# EAGLE design internal_env_board (EAGLE 8.4.3)
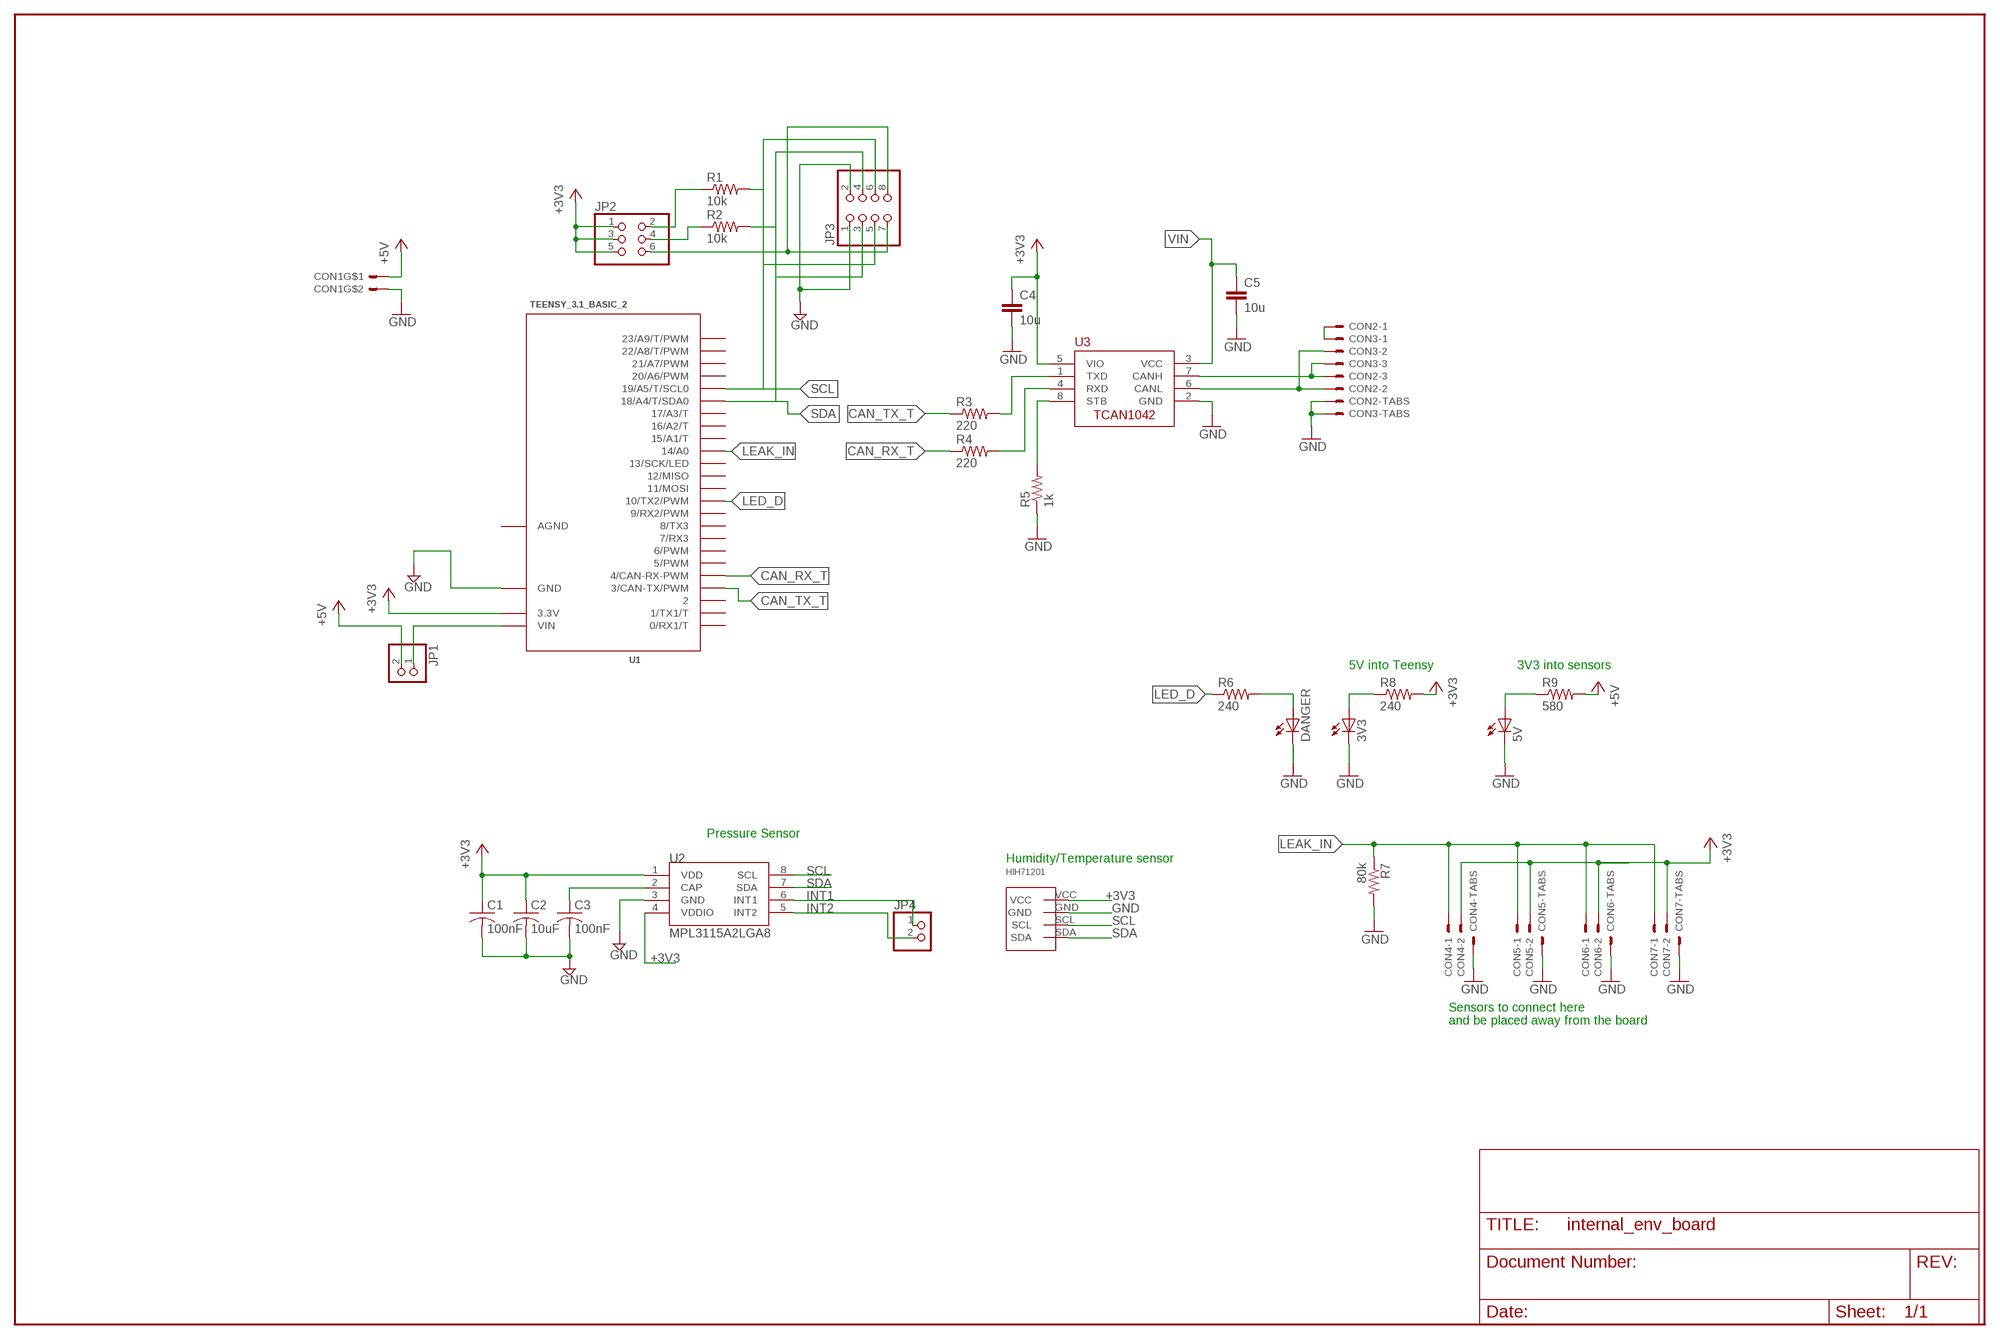
[diagram p0: schematic, sheet 1]

## Parts
3V3  LEDSMT1206  [1206]
5V  LEDSMT1206  [1206]
C1  100nF  C-USC1206  [C1206]
C2  10uF  C-USC1206  [C1206]
C3  100nF  C-USC1206  [C1206]
C4  10u  C-EUC0805  [C0805]
C5  10u  C-EUC0805  [C0805]
CON1  MOLEX_5566-2  [5566-2]
CON2  SM03B-GHS-TB  [SM03B-GHS-TB]
CON3  SM03B-GHS-TB  [SM03B-GHS-TB]
CON4  SM02B-GHS-TB  [SM02B-GHS-TB]
CON5  SM02B-GHS-TB  [SM02B-GHS-TB]
CON6  SM02B-GHS-TB  [SM02B-GHS-TB]
CON7  SM02B-GHS-TB  [SM02B-GHS-TB]
DANGER  LEDSMT1206  [1206]
HIH71201  HIH7120  [SIP4]
JP1  PINHD-1X2  [1X02]
JP2  PINHD-2X3  [2X03]
JP3  PINHD-2X4  [2X04]
JP4  PINHD-1X2  [1X02]
R1  10k  R-US_R1206  [R1206]
R2  10k  R-US_R1206  [R1206]
R3  220  R-US_R0805  [R0805]
R4  220  R-US_R0805  [R0805]
R5  1k  R-US_R0805  [R0805]
R6  240  R-US_R1206  [R1206]
R7  80k  R-US_R1206  [R1206]
R8  240  R-US_R1206  [R1206]
R9  580  R-US_R1206  [R1206]
U1  TEENSY_3.1_BASIC_2  [TEENSY_3.1_BASIC_2]
U2  MPL3115A2LGA8  [LGA8]
U3  TCAN1042HVDR  [SO-8]

## Nets
+3V3: C1.1 C2.1 C4.1 CON4.P$2 CON5.P$2 CON6.P$2 CON7.P$2 HIH71201.VCC JP2.1 JP2.3 JP2.5 R8.2 U1.3.3V U2.1(VDD) U2.4(VDDIO) U3.5(VIO)
+5V: CON1.1 JP1.2 R9.2
CAN_RX1: R4.2 U3.4(RXD)
CAN_RX_T: R4.1 U1.4(4/CAN-RX-PWM)
CAN_TX2: R3.2 U3.1(TXD)
CAN_TX_T: R3.1 U1.3(3/CAN-TX/PWM)
CANH1: CON2.P$3 CON3.P$3 U3.7(CANH)
CANL1: CON2.P$2 CON3.P$2 U3.6(CANL)
CANSH1: CON2.P$1 CON3.P$1
CAP: C3.1 U2.2(CAP)
GND: 3V3.C 5V.C C1.2 C2.2 C3.2 C4.2 C5.2 CON1.2 CON2.P$4 CON2.P$5 CON3.P$4 CON3.P$5 CON4.P$3 CON4.P$4 CON5.P$3 CON5.P$4 CON6.P$3 CON6.P$4 CON7.P$3 CON7.P$4 DANGER.C HIH71201.GND JP3.1 JP3.2 R5.1 R7.2 U1.GND U2.3(GND) U3.2(GND)
I2C_3V1: JP2.6 JP3.7 JP3.8
INT1: JP4.1 U2.6(INT1)
INT2: JP4.2 U2.5(INT2)
LEAK_IN: CON4.P$1 CON5.P$1 CON6.P$1 CON7.P$1 R7.1 U1.14/A0
LED_D: R6.1 U1.10(10/TX2/PWM)
N$2: DANGER.A R6.2
N$4: 5V.A R9.1
N$17: 3V3.A R8.1
SCL: HIH71201.SCL JP3.5 JP3.6 R1.2 U1.19/A5(19/A5/T/SCL0) U2.8(SCL)
SCL_3V1: JP2.2 R1.1
SDA: HIH71201.SDA JP3.3 JP3.4 R2.2 U1.18/A4(18/A4/T/SDA0) U2.7(SDA)
SDA_3V1: JP2.4 R2.1
STB1: R5.2 U3.8(STB)
VIN: C5.1 JP1.1 U1.VIN U3.3(VCC)
Unconnected: U1.0(0/RX1/T) U1.1(1/TX1/T) U1.2 U1.5(5/PWM) U1.6(6/PWM) U1.7(7/RX3) U1.8(8/TX3) U1.9(9/RX2/PWM) U1.11(11/MOSI) U1.12(12/MISO) U1.13(13/SCK/LED) U1.15/A1(15/A1/T) U1.16/A2(16/A2/T) U1.17/A3(17/A3/T) U1.20/A6(20/A6/PWM) U1.21/A7(21/A7/PWM) U1.22/A8(22/A8/T/PWM) U1.23/A9(23/A9/T/PWM)

## Notes on the sheet
- 5V into Teensy | 3V3 into sensors
- Pressure Sensor
- Humidity/Temperature sensor
- Sensors to connect here
  and be placed away from the board

## Power pins joined to a net without a drawn wire
AGND: U1.AGND

## Library data of the parts
3V3 5V DANGER = adafruit:LED: LED OSRAM: - CHIPLED LG R971, LG N971, LY N971, LG Q971, LY Q971, LO R971, LY R971 LH N974, LH R974 LS Q976, LO Q976, LY Q976 LO Q996 - Hyper CHIPLED LW Q18S LB Q993, LB Q99A, LB R99A - SideLED LS A670, LO A670, LY A670, LG A670, LP A670 LB A673, LV A673, LT A673, LW A673 LH A674 LY A675 LS A676, LA A676, LO A676, LY A676, LW A676 LS A679, LY A679, LG A679 - Hyper Micro SIDELED® LS Y876, LA Y876, LO Y876, LY Y876 LT Y87S - SmartLED LW L88C, LW L88S LB L89C, LB L89S, LG L890 LS L89K, LO L89K, LY L89K LS L896, LA L896, LO L896, LY L896 - TOPLED LS T670, LO T670, LY T670, LG T670, LP T670 LSG T670, LSP T670, LSY T670, LOP T670, LYG T670 LG T671, LOG T671, LSG T671 LB T673, LV T673, LT T673, LW T673 LH T674 LS T676, LA T676, LO T676, LY T676, LB T676, LH T676, LSB T676, LW T676 LB T67C, LV T67C, LT T67C, LS T67K, LO T67K, LY T67K, LW E67C LS E67B, LA E67B, LO E67B, LY E67B, LB E67C, LV E67C, LT E67C LW T67C LS T679, LY T679, LG T679 LS T770, LO T770, LY T770, LG T770, LP T770 LB T773, LV T773, LT T773, LW T773 LH T774 LS E675, LA E675, LY E675, LS T675 LS T776, LA T776, LO T776, LY T776, LB T776 LHGB T686 LT T68C, LB T68C - Hyper Mini TOPLED® LB M676 - Mini TOPLED Santana® LG M470 LS M47K, LO M47K, LY M47K Source: http://www.osram.convergy.de/
C1-C3 = rcl:C-US: CAPACITOR, American symbol
C4 C5 = rcl:C-EU: CAPACITOR, European symbol
CON1 = ARVP:MOLEX_5566-2
CON2 CON3 = ARVP:SM03B-GHS-TB
CON4-CON7 = ARVP:SM02B-GHS-TB
HIH71201 = HIH7120:HIH7120: A humidity and temperature sensor from honeywell. 2.3-5V operating voltage -40 to 85 temperature range Digikey Part #: HIH7120-021-001CT-ND
JP1 JP4 = pinhead:PINHD-1X2: PIN HEADER
JP2 = pinhead:PINHD-2X3: PIN HEADER
JP3 = pinhead:PINHD-2X4: PIN HEADER
R1-R5 = rcl:R-US_: RESISTOR, American symbol
R6-R9 = resistor:R-US_: RESISTOR, American symbol
U1 = Teensy_3_Series_Board_v1.0:TEENSY_3.1_BASIC_2: Footprint for Teensy 3.1 board using all pin connections on the outer perimeter
U2 = SparkFun-Sensors:MPL3115A2: Altimeter/Pressure Sensor, I2C, 1.95V-3.6V supply, 50 to 110kPa
U3 = ARVP:TCAN1042HVDR

## Net classes
1 net1: clearance 0.203 mm to class 0

## Board
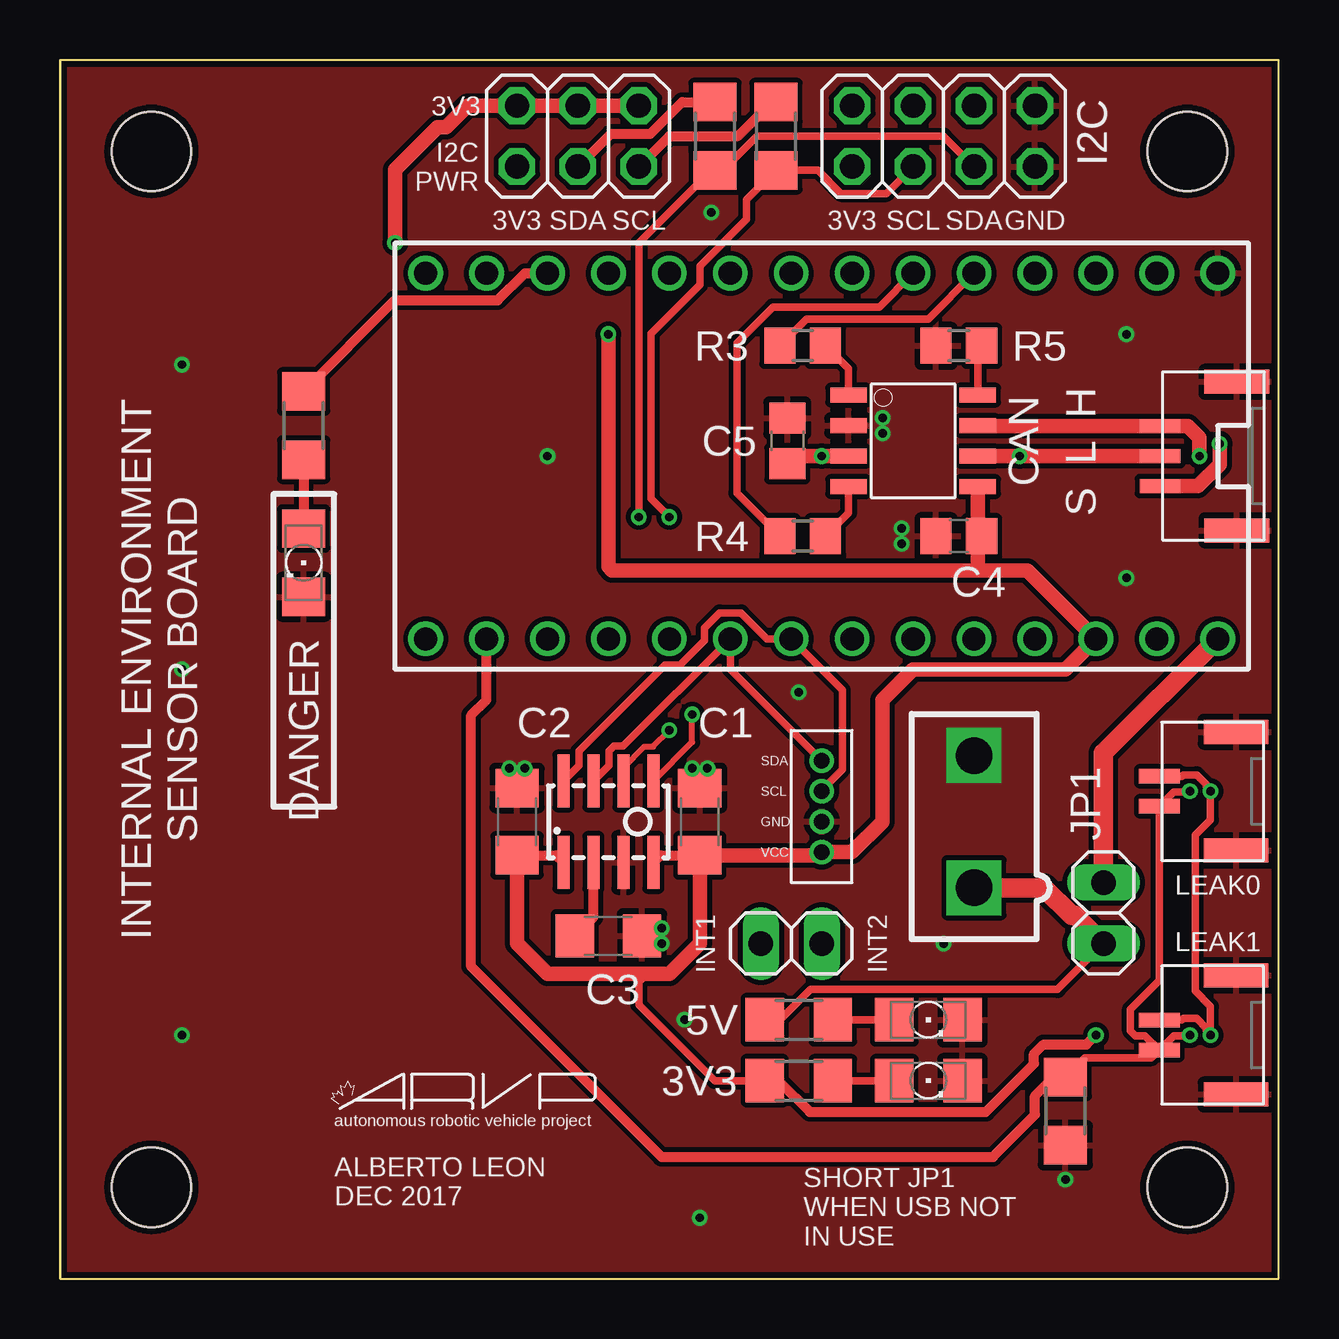
[diagram p1: board, top side]
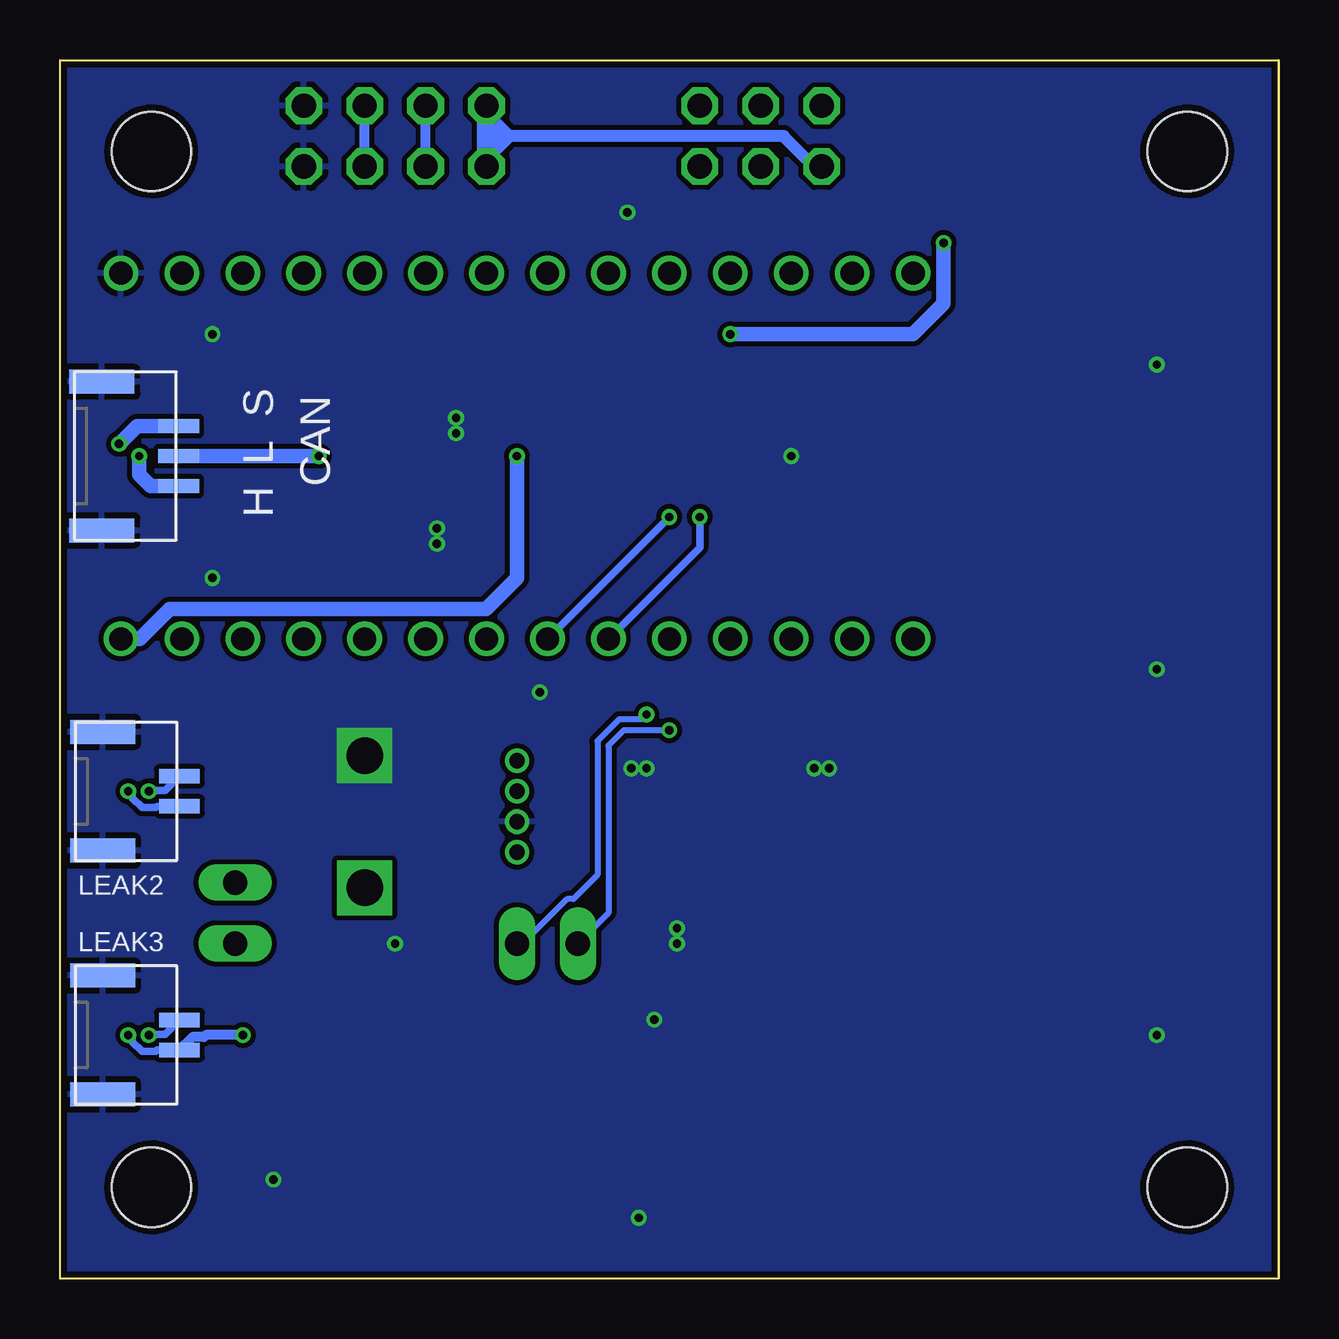
[diagram p2: board, bottom side, seen from below]

Size 50.8 x 50.8 mm. Coordinates in mm from the lower left corner, seen from the top.
Outline: 0,0 50.8,0 50.8,50.8 0,50.8 0,0
Copper layers (1*16): Top 0.035mm / dielectric 1.5mm / Bottom 0.035mm
Design rules "ITEADstudioDRC": minimum track width 6mil, minimum drill 12mil, track to track 8mil, track to pad 8mil, pad to pad 8mil, via to via 8mil, smd to smd 0mil, copper to edge 10mil, drill to drill 10mil, minimum pad ring 6mil, minimum via ring 6mil, stop-mask expansion 2mil, vias tented up to drill 100mil, thermal gap 10mil
Milling: 4 lines

### Footprints (pad centres in the part's own frame; a part is rotated, then mirrored left to right if it is on the bottom)
1206 = smd 1.6 x 1.803: A -1.422,0; C 1.422,0
C1206 = smd 1.6 x 1.8: 1 -1.4,0; 2 1.4,0
C0805 = smd 1.3 x 1.5: 1 -0.95,0; 2 0.95,0
5566-2 = drill 1.524 square: 1 0,-2.756; 2 0,2.756
SM03B-GHS-TB = smd 0.6 x 1.7: P$1 -1.25,0.85; P$2 0,0.85; P$3 1.25,0.85 | smd 1 x 2.7: P$4 -3.1,-2.35; P$5 3.1,-2.35
SM02B-GHS-TB = smd 0.6 x 1.7: P$1 -0.625,0.85; P$2 0.625,0.85 | smd 1 x 2.7: P$3 -2.475,-2.35; P$4 2.475,-2.35
SIP4 = drill 0.635 pad 1.016: GND -1.27,0; SCL 0,0; SDA 1.27,0; VCC -2.54,0
1X02 = drill 1.016 long: 1 -1.27,0; 2 1.27,0
2X03 = drill 1.016 octagon: 1 -2.54,-1.27; 2 -2.54,1.27; 3 0,-1.27; 4 0,1.27; 5 2.54,-1.27; 6 2.54,1.27
2X04 = drill 1.016 octagon: 1 -3.81,-1.27; 2 -3.81,1.27; 3 -1.27,-1.27; 4 -1.27,1.27; 5 1.27,-1.27; 6 1.27,1.27; 7 3.81,-1.27; 8 3.81,1.27
R1206 = smd 1.6 x 1.803: 1 -1.422,0; 2 1.422,0
R0805 = smd 1.3 x 1.5: 1 -0.95,0; 2 0.95,0
TEENSY_3.1_BASIC_2 = drill 0.965: 0 -7.62,13.97; 1 -7.62,11.43; 2 -7.62,8.89; 3 -7.62,6.35; 3.3V 7.62,11.43; 4 -7.62,3.81; 5 -7.62,1.27; 6 -7.62,-1.27; 7 -7.62,-3.81; 8 -7.62,-6.35; 9 -7.62,-8.89; 10 -7.62,-11.43; 11 -7.62,-13.97; 12 -7.62,-16.51; 13 7.62,-16.51; 14/A0 7.62,-13.97; 15/A1 7.62,-11.43; 16/A2 7.62,-8.89; 17/A3 7.62,-6.35; 18/A4 7.62,-3.81; 19/A5 7.62,-1.27; 20/A6 7.62,1.27; 21/A7 7.62,3.81; 22/A8 7.62,6.35; 23/A9 7.62,8.89; AGND 7.62,13.97; GND -7.62,16.51; VIN 7.62,16.51
LGA8 = smd 2.2 x 0.5: 1 -1.7,1.875; 2 -1.7,0.625; 3 -1.7,-0.625; 4 -1.7,-1.875; 5 1.7,-1.875; 6 1.7,-0.625; 7 1.7,0.625; 8 1.7,1.875
SO-8 = smd 1.524 x 0.61: 1 -2.692,1.905; 2 -2.692,0.635; 3 -2.692,-0.635; 4 -2.692,-1.905; 5 2.692,-1.905; 6 2.692,-0.635; 7 2.692,0.635; 8 2.692,1.905
STAND-OFF = hole 3.302: 0,0

### Placement (x,y rotation side)
3V3  36.19,8.25 0 top
5V  36.19,10.8 0 top
C1  26.67,19.05 90 top
C2  19.05,19.05 90 top
C3  22.86,14.29 0 top
C4  37.47,30.96 180 top
C5  30.32,34.92 90 top
CON1  38.1,19.05 0 top
CON2  46.7,34.29 90 top
CON3  46.7,34.29 270 bottom
CON4  46.67,10.16 270 bottom
CON5  46.67,20.32 270 bottom
CON6  46.67,10.16 90 top
CON7  46.67,20.32 90 top
DANGER  10.16,29.84 270 top
HIH71201  31.75,20.32 90 top
JP1  43.5,15.24 270 top
JP2  21.59,47.62 180 top
JP3  36.83,47.62 180 top
JP4  30.48,13.97 0 top
R1  29.84,47.62 270 top
R2  27.3,47.62 270 top
R3  30.96,38.89 0 top
R4  30.96,30.96 0 top
R5  37.47,38.89 0 top
R6  10.16,35.56 270 top
R7  41.91,6.98 270 top
R8  30.8,8.25 180 top
R9  30.8,10.8 180 top
U1  31.75,34.29 270 top
U2  22.86,19.05 90 top
U3  35.56,34.92 0 top
U$1  [LOGO2]  11.43,6.35 0 top
U$2  [LETTER_P]  -67.31,-107.95 0 top  (outside the outline)
U$3  [DOCFIELD]  16.51,-107.95 0 top  (outside the outline)
U$5  [STAND-OFF]  46.99,3.81 0 top
U$6  [STAND-OFF]  3.81,3.81 0 top
U$7  [STAND-OFF]  3.81,46.99 0 top
U$8  [STAND-OFF]  46.99,46.99 0 top

### Tracks (layer width: path | path; a pad name or v marks a point on that pad's centre or on a via)
+3V3  (via drill 0.35)
  Top 0.305: 20.94,12.69 20.95,12.7 | R8.2 27.3,8.25 24.13,11.42 24.13,12.7 | 23.81,12.7 24.13,12.38 24.45,12.7 | CON6.P$2 46.76,10.78 46.81,10.84 47.38,10.84 47.78,10.44 47.78,10.33 v47.96,10.16 47.96,11.35 47.32,11.99 47.32,18.49 47.96,19.13 v47.96,20.32 47.78,20.49 47.78,20.6 47.38,21 46.81,21 46.76,20.95 CON7.P$2
  Top 0.406: C2.1 20.69,17.65 U2.1 | C1.1 25.03,17.65 U2.4 | v43.18,10.16 42.79,9.77 40.99,9.77 40.6,9.38 40.6,8.96 38.58,6.95 31.25,6.95 29.94,8.25 R8.2
  Top 0.61: JP2.1 JP2.3 JP2.5 16.99,48.89 16.1,48.01 15.75,48.01 13.97,46.23 v13.97,43.18 | 38.25,31.12 U3.5 | 38.25,31.12 C4.1 38.26,30.8 38.26,29.53 | 38.25,30.96 38.25,31.12 | U1.3.3V 43.18,26.54 | U1.3.3V 40.32,29.53 38.26,29.53 | 38.26,29.53 23.02,29.53 22.86,29.69 v22.86,39.37 | C2.1 19.05,13.97 20.32,12.7 20.95,12.7 23.81,12.7 24.13,12.7 24.45,12.7 25.4,12.7 26.67,13.97 C1.1 31.62,17.65 HIH71201.VCC 33.02,17.78 34.29,19.05 34.29,24.13 35.56,25.4 41.91,25.4 U1.3.3V
  Bottom 0.305: v47.96,10.16 47.78,9.98 47.78,9.88 47.38,9.48 46.81,9.48 46.76,9.53 CON4.P$2 | v47.96,20.32 47.78,20.14 47.78,20.04 47.38,19.64 46.81,19.64 46.76,19.69 CON5.P$2
  Bottom 0.406: v43.18,10.16 44.72,10.16 44.8,10.08 45.28,10.08 CON4.P$2
  Bottom 0.61: v13.97,43.18 13.97,40.64 15.24,39.37 v22.86,39.37
+5V
  Top 0.305: JP1.2 41.58,12.05 31.27,12.05 30.02,10.8 R9.2
  Top 0.813: JP1.2 42.33,15.14 42.17,15.14 41.01,16.29 CON1.1
CAN_RX1
  Top 0.305: U3.4 32.87,31.92 R4.2
CAN_RX_T
  Top 0.305: U1.4 34.16,40.51 29.72,40.51 28.21,39 28.21,32.75 R4.1
CAN_TX2
  Top 0.305: U3.1 32.87,37.93 R3.2
CAN_TX_T
  Top 0.305: U1.3 36.19,40 31.11,40 30.9,39.79 R3.1
CANH1  (via drill 0.35)
  Top 0.61: U3.7 38.27,35.54 CON2.P$3 47.01,35.54 47.5,35.05 v47.5,34.29
  Bottom 0.61: v47.5,34.29 47.5,33.53 47.01,33.04 CON3.P$3
CANL1  (via drill 0.35)
  Top 0.61: U3.6 v40,34.29 CON3.P$2
  Bottom 0.61: v40,34.29 CON3.P$2
CANSH1  (via drill 0.35)
  Top 0.61: v48.33,34.8 48.33,33.94 47.43,33.04 CON2.P$1
  Bottom 0.61: CON3.P$1 47.59,35.54 v48.33,34.8
CAP
  Top 0.406: C3.1 22.23,15.06 U2.2
GND  (via drill 0.35)
  other vias: 35.08,31.27 35.08,30.64 34.29,35.88 34.29,35.24 27.15,44.45 26.03,10.8 5.08,10.16 5.08,25.4 5.08,38.1 36.83,13.97 20.32,34.29 44.45,39.37 44.45,29.21 18.73,21.27 19.37,21.27 26.35,21.27 26.99,21.27 25.08,13.97 25.08,14.61 41.91,4.13 30.8,24.45 26.67,2.54
  pour Bottom (rank 2): 0.32,0.32 50.48,0.32 50.48,50.48 0.32,50.48
  pour Top (rank 3): 0.32,0.32 50.48,0.32 50.48,50.48 0.32,50.48
  pour Top (no thermals): 36.54,19.65 39.66,19.65 39.66,23.78 36.54,23.78
  pour Bottom (no thermals): 36.54,19.65 39.66,19.65 39.66,23.78 36.54,23.78
I2C_3V1
  Bottom 0.508: JP2.6 19.37,46.36 20.64,47.62 33.02,47.62 | 33.02,48.58 32.07,47.62 33.02,46.67
  Bottom 0.813: JP3.7 33.02,48.58 33.02,47.62 33.02,46.67 JP3.8
INT1  (via drill 0.35)
  Top 0.254: v25.4,22.86 24.72,22.18 24.35,22.18 23.48,21.32 U2.6
  Bottom 0.254: v25.4,22.86 27.3,22.86 27.94,22.23 27.94,15.24 JP4.1
INT2  (via drill 0.35)
  Top 0.254: U2.5 26.35,22.37 v26.35,23.52
  Bottom 0.254: v26.35,23.52 26.55,23.32 27.49,23.32 28.4,22.41 28.4,16.83 29.4,15.82 29.66,15.82 31.52,13.97 JP4.2
LEAK_IN  (via drill 0.35)
  Top 0.305: CON6.P$1 45.5,9.21 42.71,9.21 R7.1 | CON6.P$1 46.42,10.13 46.82,10.13 46.85,10.16 v47.1,10.16 | v47.1,20.32 46.85,20.32 46.82,20.29 46.42,20.29 CON7.P$1 45.82,12.44 44.62,11.23 44.62,10.34 44.83,10.13 45.23,10.13 CON6.P$1
  Top 0.406: U1.14/A0 17.78,24.13 17.14,23.49 17.14,13.02 25.08,5.08 38.89,5.08 40.64,6.83 40.64,7.62 41.43,8.41 R7.1
  Bottom 0.305: v47.1,10.16 46.85,10.16 46.82,10.19 46.42,10.19 CON4.P$1 | v47.1,20.32 46.85,20.32 46.82,20.35 46.42,20.35 CON5.P$1
LED_D
  Top 0.406: R6.1 13.96,40.78 18.25,40.78 19.38,41.91 U1.10
N$2
  Top 0.406: R6.2 DANGER.A
N$4
  Top 0.305: 5V.A R9.1
N$17
  Top 0.305: R8.1 3V3.A
SCL  (via drill 0.35)
  Top 0.305: v25.4,31.75 24.64,32.51 24.64,39.4 26.67,41.43 26.67,42.21 28.62,44.17 28.62,44.98 R1.2 31.59,46.2 32.56,45.24 34.44,45.24 JP3.6 | U2.8 21.63,21.39 21.63,22 25.22,25.59 25.85,25.59 26.86,26.6 26.86,27.12 27.49,27.75 28.39,27.75 29.47,26.67 U1.19/A5 32.61,24.54 32.61,21.23 31.75,20.37 HIH71201.SCL
  Bottom 0.305: v25.4,31.75 U1.19/A5
  Bottom 0.406: JP3.6 JP3.5
SCL_3V1
  Top 0.406: JP2.2 25.4,47.62 28.26,47.62 29.68,49.05 R1.1
SDA  (via drill 0.35)
  Top 0.305: v24.13,31.75 24.13,43.18 27.15,46.2 R2.2 27.63,46.2 29.05,47.62 36.83,47.62 JP3.4 | U2.7 22.88,21.39 22.88,22 23.09,22.21 23.48,22.21 U1.18/A4 27.94,25.4 HIH71201.SDA
  Bottom 0.305: v24.13,31.75 24.13,30.48 U1.18/A4
  Bottom 0.406: JP3.4 JP3.3
SDA_3V1
  Top 0.406: JP2.4 22.96,47.73 24.61,47.73 25.93,49.05 R2.1
STB1
  Top 0.305: R5.2 38.25,38.73 U3.8
VIN  (via drill 0.35)
  Top 0.61: C5.1 30.48,34.29 v31.75,34.29 U3.3 33.02,34.29
  Top 0.813: JP1.1 43.5,21.91 U1.VIN
  Bottom 0.61: U1.VIN 47.48,26.67 46.24,27.92 33.05,27.92 31.75,29.21 v31.75,34.29

### Text on the board
tNames: 3V3 | I2C | I2C / PWR | 3V3 | SDA | SCL | 3V3 | SCL | SDA | GND | H | CAN | L | S | INTERNAL ENVIRONMENT / SENSOR BOARD | LEAK0 | INT1 | INT2 | LEAK1 | ALBERTO LEON / DEC 2017 | SHORT JP1 / WHEN USB NOT / IN USE
bNames: S | CAN | L | H | LEAK2 | LEAK3